# Altium schematic sheet Sheet1.SchDoc
size A; SheetNumber: 1; SheetTotal: 1
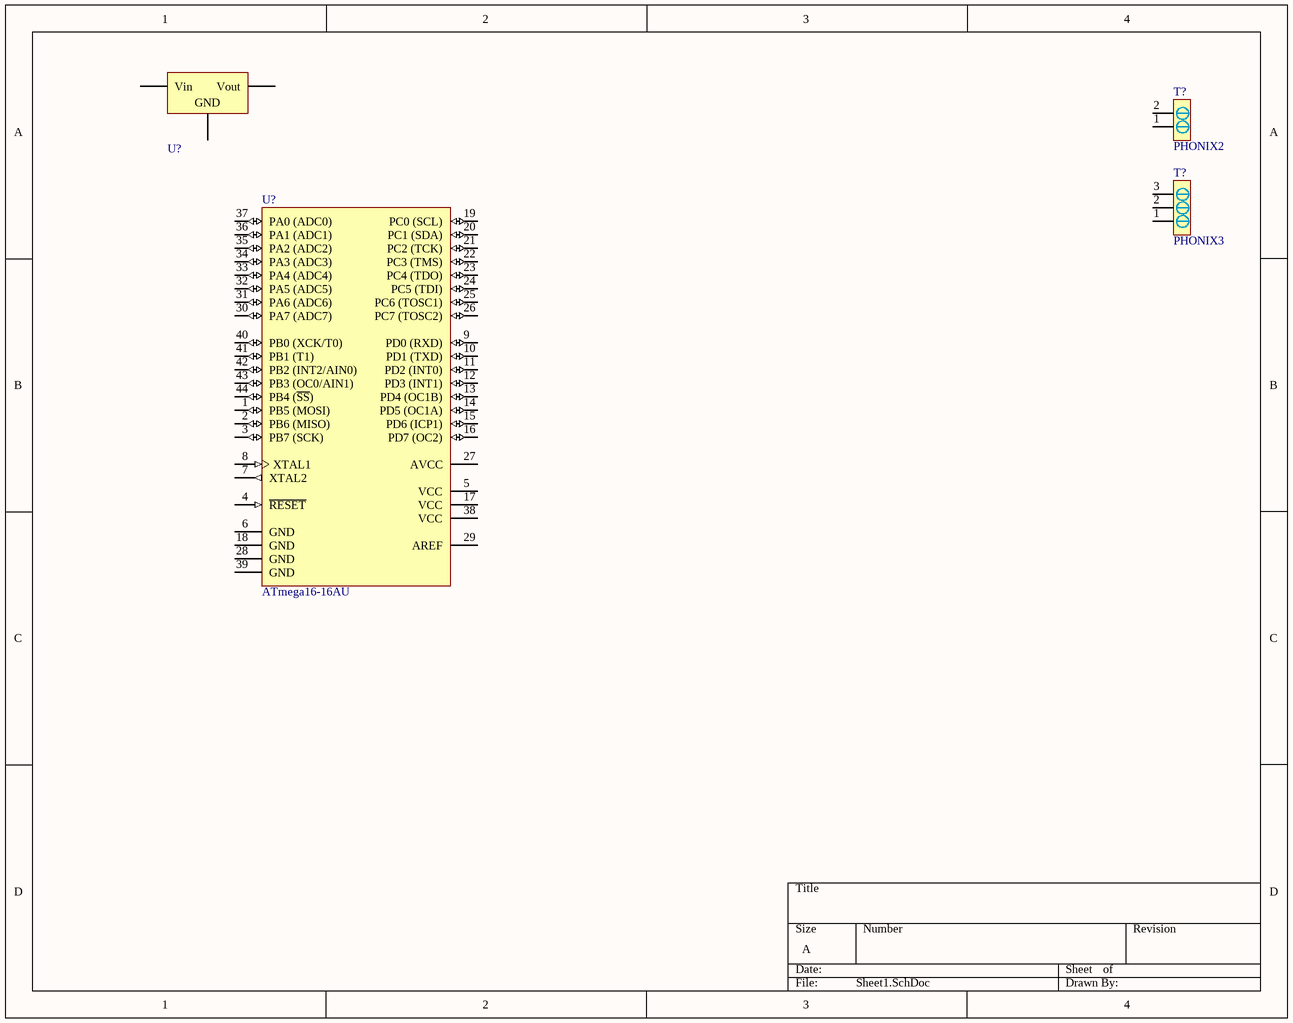
[diagram p0: Sheet1.SchDoc]

## Parts
(Parts that share a designator on the sheet are numbered #1, #2 ... from top to bottom, then left to right.)
T?#1  PHONIX2  [PHONIX2]
T?#2  PHONIX3  [PHONIX3]
U?#1  ASM1117  [MY_SOT223]  (value not drawn)
U?#2  ATmega16-16AU  [44A_L]

## Nets

Not connected (* = marked no-connect by the designer): T?#1 1 2; T?#2 1 2 3; U?#1 1(GND) 2(Vout) 3(Vin); U?#2 1(PB5_(MOSI)) 2(PB6_(MISO)) 3(PB7_(SCK)) 4(~{RESET}) 5(VCC) 6(GND) 7(XTAL2) 8(XTAL1) 9(PD0_(RXD)) 10(PD1_(TXD)) 11(PD2_(INT0)) 12(PD3_(INT1)) 13(PD4_(OC1B)) 14(PD5_(OC1A)) 15(PD6_(ICP1)) 16(PD7_(OC2)) 17(VCC) 18(GND) 19(PC0_(SCL)) 20(PC1_(SDA)) 21(PC2_(TCK)) 22(PC3_(TMS)) 23(PC4_(TDO)) 24(PC5_(TDI)) 25(PC6_(TOSC1)) 26(PC7_(TOSC2)) 27(AVCC) 28(GND) 29(AREF) 30(PA7_(ADC7)) 31(PA6_(ADC6)) 32(PA5_(ADC5)) 33(PA4_(ADC4)) 34(PA3_(ADC3)) 35(PA2_(ADC2)) 36(PA1_(ADC1)) 37(PA0_(ADC0)) 38(VCC) 39(GND) 40(PB0_(XCK/T0)) 41(PB1_(T1)) 42(PB2_(INT2/AIN0)) 43(PB3_(OC0/AIN1)) 44(PB4_(~{SS}))

## Library data of the parts
U?#1 = ASM1117: Low Drop Voltage Reg
U?#2 = CMP-0095-00235-2: 8-bit AVR Microcontroller, 4.5-5.5V, 16KB Flash, 512 Bytes EEPROM, 1KB SRAM, 44-pin TQFP, Industrial Grade (-40°C to 85°C), Pb-Free; ComponentLink3URL: http://www.atmel.com/dyn/resources/prod_documents/2466S.pdf; ComponentLink1URL: http://www.atmel.com/; ComponentLink1Description: Manufacturer URL; Code_JEDEC: MS-026-ACB; ComponentLink2URL: http://www.atmel.com/dyn/resources/prod_documents/doc2466.pdf; DatasheetVersion: revT, Jul-2010; ComponentLink2Description: ATmega16(L)  Datasheet; PackageReference: 44A; PackageDescription: 44-Pin Plastic Thin Profile Quad Flat Pack, 10 x 10 x 1.0 mm Body, 0.8 mm Pitch (TQFP); RevisionNote: DatasheetVersion & PackageVersion updated. URLs added.; ComponentLink3Description: ATmega16(L) Summary; PackageVersion: revC, Oct-2010